# Altium schematic sheet CLK_buffer_DRTIO_CDR.SchDoc: Kasli-DIOT
size 420 x 297 mm; EDA_Number: EDA-04514-V3-0; Projet: DI/OT System Board; Author: G.Kasprowicz; CompanyName: WUT ISE; DrawnBy: F.Świtakowski; Organization: WUT ISE; Address1: PW ISE; Address2: Nowowiejska 15/19 00-665 Warsaw; Address3: gkasprow@gmail.com; DocumentNumber: 15; SheetNumber: 12; SheetTotal: 16; ModifiedBy: -; CheckedDate: -; Title2: CLK buffer DRTIo; DivGrp: WUT ISE; Designer: F.Świtakowski; ModifiedDate: -; ProjectName: Sensor Box
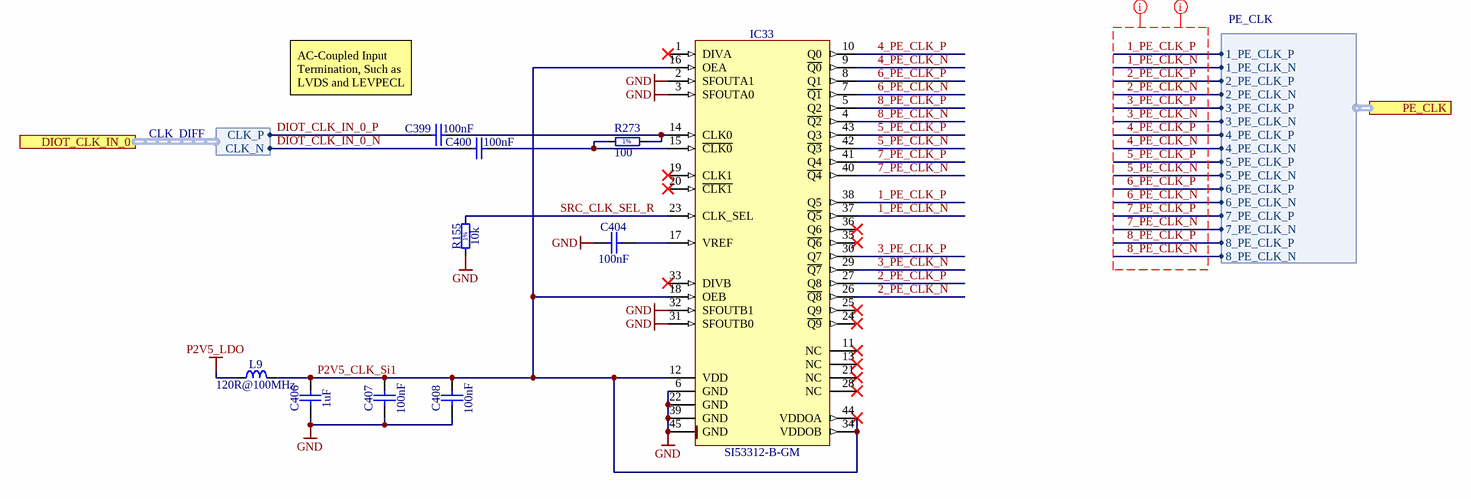
[diagram p0: CLK_buffer_DRTIO_CDR.SchDoc]

## Parts
C399  100nF  [CAPC0603X33N]
C400  100nF  [CAPC0603X33N]
C404  100nF  [CAPC1005X55N]
C406  1uF  [CAPC1608X87N]
C407  100nF  [CAPC1005X55N]
C408  100nF  [CAPC1005X55N]
IC33  SI53312-B-GM  [QFN50P700X700X90-45N-S295]
L9  120R@100MHz  [INDC1608X95N]
R155  10k  [RESC1005X40N]
R273  100  [RESC1005X40N]

## Ports
DIOT_CLK_IN_0 (harness CLK_DIFF), PE_CLK (harness PE_CLK)

## Harnesses
PE_CLK: 1_PE_CLK_P, 1_PE_CLK_N, 2_PE_CLK_P, 2_PE_CLK_N, 3_PE_CLK_P, 3_PE_CLK_N, 4_PE_CLK_P, 4_PE_CLK_N, 5_PE_CLK_P, 5_PE_CLK_N, 6_PE_CLK_P, 6_PE_CLK_N, 7_PE_CLK_P, 7_PE_CLK_N, 8_PE_CLK_P, 8_PE_CLK_N
CLK_DIFF: CLK_P, CLK_N

## Nets
GND: C404.1 C406.1 C407.1 C408.1 IC33.2(SFOUTA1) IC33.3(SFOUTA0) IC33.6(GND) IC33.22(GND) IC33.31(SFOUTB0) IC33.32(SFOUTB1) IC33.39(GND) IC33.45(GND) R155.1
P2V5_LDO: L9.2
1_PE_CLK_N: IC33.37(~{Q5}) ; port PE_CLK.1_PE_CLK_N
1_PE_CLK_P: IC33.38(Q5) ; port PE_CLK.1_PE_CLK_P
2_PE_CLK_N: IC33.26(~{Q8}) ; port PE_CLK.2_PE_CLK_N
2_PE_CLK_P: IC33.27(Q8) ; port PE_CLK.2_PE_CLK_P
3_PE_CLK_N: IC33.29(~{Q7}) ; port PE_CLK.3_PE_CLK_N
3_PE_CLK_P: IC33.30(Q7) ; port PE_CLK.3_PE_CLK_P
4_PE_CLK_N: IC33.9(~{Q0}) ; port PE_CLK.4_PE_CLK_N
4_PE_CLK_P: IC33.10(Q0) ; port PE_CLK.4_PE_CLK_P
5_PE_CLK_N: IC33.42(~{Q3}) ; port PE_CLK.5_PE_CLK_N
5_PE_CLK_P: IC33.43(Q3) ; port PE_CLK.5_PE_CLK_P
6_PE_CLK_N: IC33.7(~{Q1}) ; port PE_CLK.6_PE_CLK_N
6_PE_CLK_P: IC33.8(Q1) ; port PE_CLK.6_PE_CLK_P
7_PE_CLK_N: IC33.40(~{Q4}) ; port PE_CLK.7_PE_CLK_N
7_PE_CLK_P: IC33.41(Q4) ; port PE_CLK.7_PE_CLK_P
8_PE_CLK_N: IC33.4(~{Q2}) ; port PE_CLK.8_PE_CLK_N
8_PE_CLK_P: IC33.5(Q2) ; port PE_CLK.8_PE_CLK_P
DIOT_CLK_IN_0_N: C400.1 ; port DIOT_CLK_IN_0.CLK_N
DIOT_CLK_IN_0_P: C399.1 ; port DIOT_CLK_IN_0.CLK_P
P2V5_CLK_Si1: C406.2 C407.2 C408.2 IC33.12(VDD) IC33.16(OEA) IC33.18(OEB) IC33.34(VDDOB) IC33.44(VDDOA) L9.1
SRC_CLK_SEL_R: IC33.23(CLK_SEL) R155.2
NetC399_2: C399.2 IC33.14(CLK0) R273.2
NetC400_2: C400.2 IC33.15(~{CLK0}) R273.1
NetC404_2: C404.2 IC33.17(VREF)

Not connected (* = marked no-connect by the designer): IC33 1(DIVA)* 11(NC)* 13(NC)* 19(CLK1)* 20(~{CLK1})* 21(NC)* 24(~{Q9})* 25(Q9)* 28(NC)* 33(DIVB)* 35(~{Q6})* 36(Q6)*

## Layout directives
net class D100: 1_PE_CLK_N, 1_PE_CLK_P, 2_PE_CLK_N, 2_PE_CLK_P, 3_PE_CLK_N, 3_PE_CLK_P, 4_PE_CLK_N, 4_PE_CLK_P, 5_PE_CLK_N, 5_PE_CLK_P, 6_PE_CLK_N, 6_PE_CLK_P, 7_PE_CLK_N, 7_PE_CLK_P, 8_PE_CLK_N, 8_PE_CLK_P
net class PE_CLK: 1_PE_CLK_N, 1_PE_CLK_P, 2_PE_CLK_N, 2_PE_CLK_P, 3_PE_CLK_N, 3_PE_CLK_P, 4_PE_CLK_N, 4_PE_CLK_P, 5_PE_CLK_N, 5_PE_CLK_P, 6_PE_CLK_N, 6_PE_CLK_P, 7_PE_CLK_N, 7_PE_CLK_P, 8_PE_CLK_N, 8_PE_CLK_P

## Notes on the sheet
- (near C399) AC-Coupled Input Termination, Such as LVDS and LEVPECL
- Project/Equipment
- Document
- Designer
- Drawn by
- Check.by
- Copyright WUT ISE 2024.
  This documentation describes Open Hardware and is licensed under the CERN OHL-W v.2.0. You may redistribute and modify this documentation under the terms of the CERN OHL-W v.2.0. (http://ohwr.org/CERNOHL). This documentation is distributed WITHOUT ANY EXPRESS OR IMPLIED WARRANTY, INCLUDING OF MERCHANTABILITY, SATISFACTORY QUALITY AND FITNESS FOR A PARTICULAR PURPOSE. Please see the CERN OHL v.2.0 for applicable conditions.
- Contact
- File
- Last Mod.
- Print Date
- Sheet
- Size
- A3
- of
- Rev
- (in symbol R0402_10K_1%_0.0625W_100PPM) 1%
- (in symbol R0402_100R_1%_0.0625W_100PPM) 1%

## Library data of the parts
C399 C400 = CC0201_100NF_6.3V_10%_X5R: Non-polarised capacitor; Part Description: SMD Multilayer Chip Ceramic Capacitor; Manufacturer: GENERIC; Manufacturer1 Part Number: 02016D104KAT2A; Voltage: 6.3V; TC: X5R; Tolerance: ±10%; Part Number: CC0201_100NF_6.3V_10%_X5R; Component Kind: Standard; Component Type: Standard; Pin Count: 2; Value: 100nF; Status: Not Recommended; Manufacturer Part Number: CC0201_100NF_6.3V_10%_X5R; Case: 0201; Mounted: Yes; Socket: No; SMD: Yes; Sense: No; Manufacturer1 Example: AVX; Manufacturer1 ComponentHeight: 0.33mm; HelpURL: \\cern.ch\dfs\Applications\Altium\Datasheets\CC0201_X5R_AVX.pdf; Author: CERN DEM JLC; CreateDate: 03.12.2007; LatestRevisionDate: 03.12.2007
C404 C407 C408 = CC0402_100NF_16V_10%_X7R: Non-polarised capacitor; Part Description: SMD Multilayer Chip Ceramic Capacitor; Manufacturer: GENERIC; Manufacturer1 Part Number: GRM155R71C104KA88D; Voltage: 16V; TC: X7R; Tolerance: ±10%; Part Number: CC0402_100NF_16V_10%_X7R; Component Kind: Standard; Component Type: Standard; Pin Count: 2; Value: 100nF; Status: Not Recommended; Manufacturer Part Number: CC0402_100NF_16V_10%_X7R; Case: 0402; Mounted: Yes; Socket: No; SMD: Yes; Sense: No; Manufacturer1 Example: MURATA; Manufacturer1 ComponentHeight: 0.55mm; HelpURL: \\cern.ch\dfs\Applications\Altium\Datasheets\CC0402_X7R_MURATA_GRM.pdf; Author: CERN DEM JLC; CreateDate: 05/12/2013; LatestRevisionDate: 03/12/2007
C406 = CC0603_1UF_25V_10%_X7R: Non-polarised capacitor; Part Description: SMD Multilayer Chip Ceramic Capacitor; Manufacturer: GENERIC; Manufacturer1 Part Number: GRM188R71E105KA12D; Voltage: 25V; TC: X7R; Tolerance: ±10%; Part Number: CC0603_1UF_25V_10%_X7R; Component Kind: Standard; Component Type: Standard; Pin Count: 2; Value: 1uF; Status: None; Manufacturer Part Number: CC0603_1UF_25V_10%_X7R; Case: 0603; Mounted: Yes; Socket: No; SMD: Yes; Sense: No; Manufacturer1 Example: MURATA; Manufacturer1 ComponentHeight: 0.9mm; HelpURL: \\cern.ch\dfs\Applications\Altium\Datasheets\CC0603_X7R_MURATA.pdf; Author: CERN DEM JLC; CreateDate: 18.01.2011; LatestRevisionDate: 18.01.2011
IC33 = SI53312-B-GM: 2 Input/10 Output, Low Jitter Universal Buffer/Level Translator With 2:1 Input Mux (<1.25 GHZ); Manufacturer: SILICON LABS; PressFit: No; Bonding: No; Part Number: SI53312-B-GM; Component Kind: Standard; Component Type: Standard; Device: SI53312-B-GM; PackageDescription: QFN, 0.50mm Pitch, Square; 44 Pin, 7.00mm L X 7.00mm W X 0.90mm H body (w/Thermal Tab 2.95 X 2.95mm), IPC Medium Density; Part Description: 2 Input/10 Output, Low Jitter Universal Buffer/Level Translator With 2:1 Input Mux (<1.25 GHZ); Manufacturer Part Number: SI53312-B-GM; Pin Count: 45; Case: QFN44; Mounted: Yes; Socket: No; SMD: Yes; Sense: No; ComponentHeight: 0.9mm; Author: CERN DEM MR; HelpURL: \\cern.ch\dfs\Applications\Altium\Datasheets\SI53312-B-GM.pdf; CreateDate: 02.10.2017; LatestRevisionDate: 02.10.2017
L9 = IND0603_MURATA_BLM18PG121SN1D: Inductor; Part Description: SMD EMIFIL Chip Ferrite Bead; Manufacturer: MURATA; Power: 2A; Resistance: 0.05R; Part Number: IND0603_MURATA_BLM18PG121SN1D; Component Kind: Standard; Component Type: Standard; Pin Count: 2; Value: 120R@100MHz; Status: None; Manufacturer Part Number: BLM18PG121SN1D; Case: 0603; Mounted: Yes; Socket: No; SMD: Yes; Sense: No; ComponentHeight: 0.95mm; HelpURL: \\cern.ch\dfs\Applications\Altium\Datasheets\IND0603_MURATA_BLM18P.pdf; Author: CERN DEM BC; CreateDate: 2015-07-27; LatestRevisionDate: 2015-07-27
R155 = R0402_10K_1%_0.0625W_100PPM: Resistor - 1%; Part Description: General Purpose Thick Film Chip Resistor; Manufacturer: GENERIC; Manufacturer1 Part Number: 232270671003L; TC: ±100ppm/°C; PressFit: No; Part Number: R0402_10K_1%_0.0625W_100PPM; Component Kind: Standard; Component Type: Standard; Pin Count: 2; Value: 10k; Status: Not Recommended; Power: 0.0625W; Tolerance: ±1%; Manufacturer Part Number: R0402_10K_1%_0.0625W_100PPM; Case: 0402; Mounted: Yes; Sense: No; Socket: No; SMD: Yes; Manufacturer1 Example: YAGEO PHYCOMP; Manufacturer1 ComponentHeight: 0.4mm; HelpURL: \\cern.ch\dfs\Applications\Altium\Datasheets\R0402_Phycomp_RC0402.pdf; Author: CERN DEM JLC; CreateDate: 03.12.2007; LatestRevisionDate: 17.10.2012
R273 = R0402_100R_1%_0.0625W_100PPM: Resistor - 1%; Part Description: General Purpose Thick Film Chip Resistor; Manufacturer: GENERIC; Manufacturer1 Part Number: 232270671001L; TC: ±100ppm/°C; PressFit: No; Part Number: R0402_100R_1%_0.0625W_100PPM; Component Kind: Standard; Component Type: Standard; Pin Count: 2; Value: 100; Status: Not Recommended; Power: 0.0625W; Tolerance: ±1%; Manufacturer Part Number: R0402_100R_1%_0.0625W_100PPM; Case: 0402; Mounted: Yes; Sense: No; Socket: No; SMD: Yes; Manufacturer1 Example: YAGEO PHYCOMP; Manufacturer1 ComponentHeight: 0.4mm; HelpURL: \\cern.ch\dfs\Applications\Altium\Datasheets\R0402_Phycomp_RC0402.pdf; Author: CERN DEM JLC; CreateDate: 03.12.2007; LatestRevisionDate: 17.10.2012